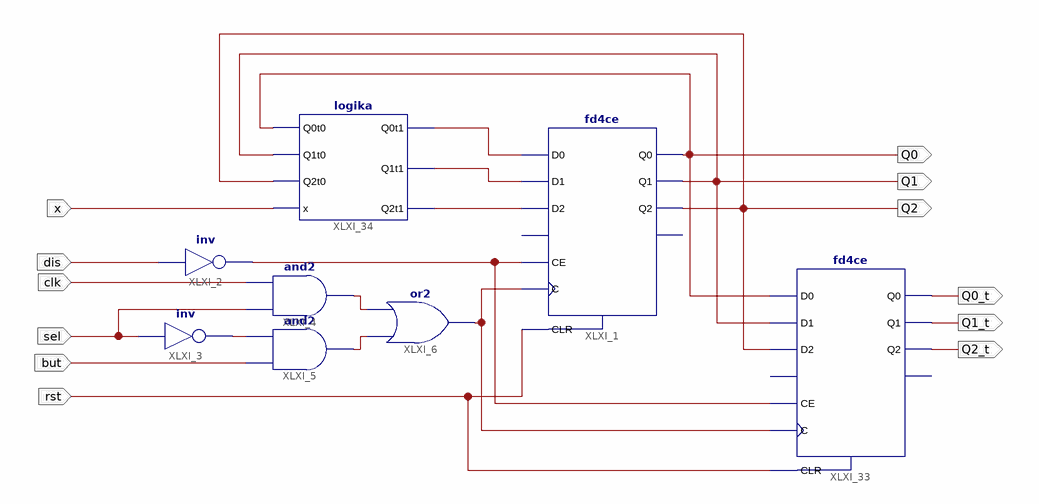
[diagram p0: schematic sheet 1]
// Xilinx ISE schematic automat.sch (spartan3e) as structural Verilog: 8 symbols, 12 ports
module automat (
  input  dis,
  input  rst,
  input  sel,
  input  but,
  input  clk,
  input  x,
  output Q0,
  output Q1,
  output Q2,
  output Q0_t,
  output Q1_t,
  output Q2_t
);

  wire XLXN_39, XLXN_40, XLXN_41, XLXN_43, XLXN_44, XLXN_85, XLXN_86, XLXN_88;

  not XLXI_2 (XLXN_44, dis);
  not XLXI_3 (XLXN_39, sel);
  and XLXI_5 (XLXN_41, but, XLXN_39);
  fd4ce XLXI_1 (
    .C(XLXN_43), .CE(XLXN_44), .CLR(rst), .D0(XLXN_88), .D1(XLXN_86), .D2(XLXN_85), .Q0(Q0), .Q1(Q1), .Q2(Q2));  // open: D3, Q3
  and XLXI_4 (XLXN_40, sel, clk);
  or XLXI_6 (XLXN_43, XLXN_41, XLXN_40);
  fd4ce XLXI_33 (
    .C(XLXN_43), .CE(XLXN_44), .CLR(rst), .D0(Q0), .D1(Q1), .D2(Q2), .Q0(Q0_t), .Q1(Q1_t), .Q2(Q2_t));  // open: D3, Q3
  logika XLXI_34 (.x(x), .Q0t0(Q0), .Q1t0(Q1), .Q2t0(Q2), .Q0t1(XLXN_88), .Q2t1(XLXN_85), .Q1t1(XLXN_86));
endmodule
